# Altium project Powerboard V2 PCB Project.PrjPCB
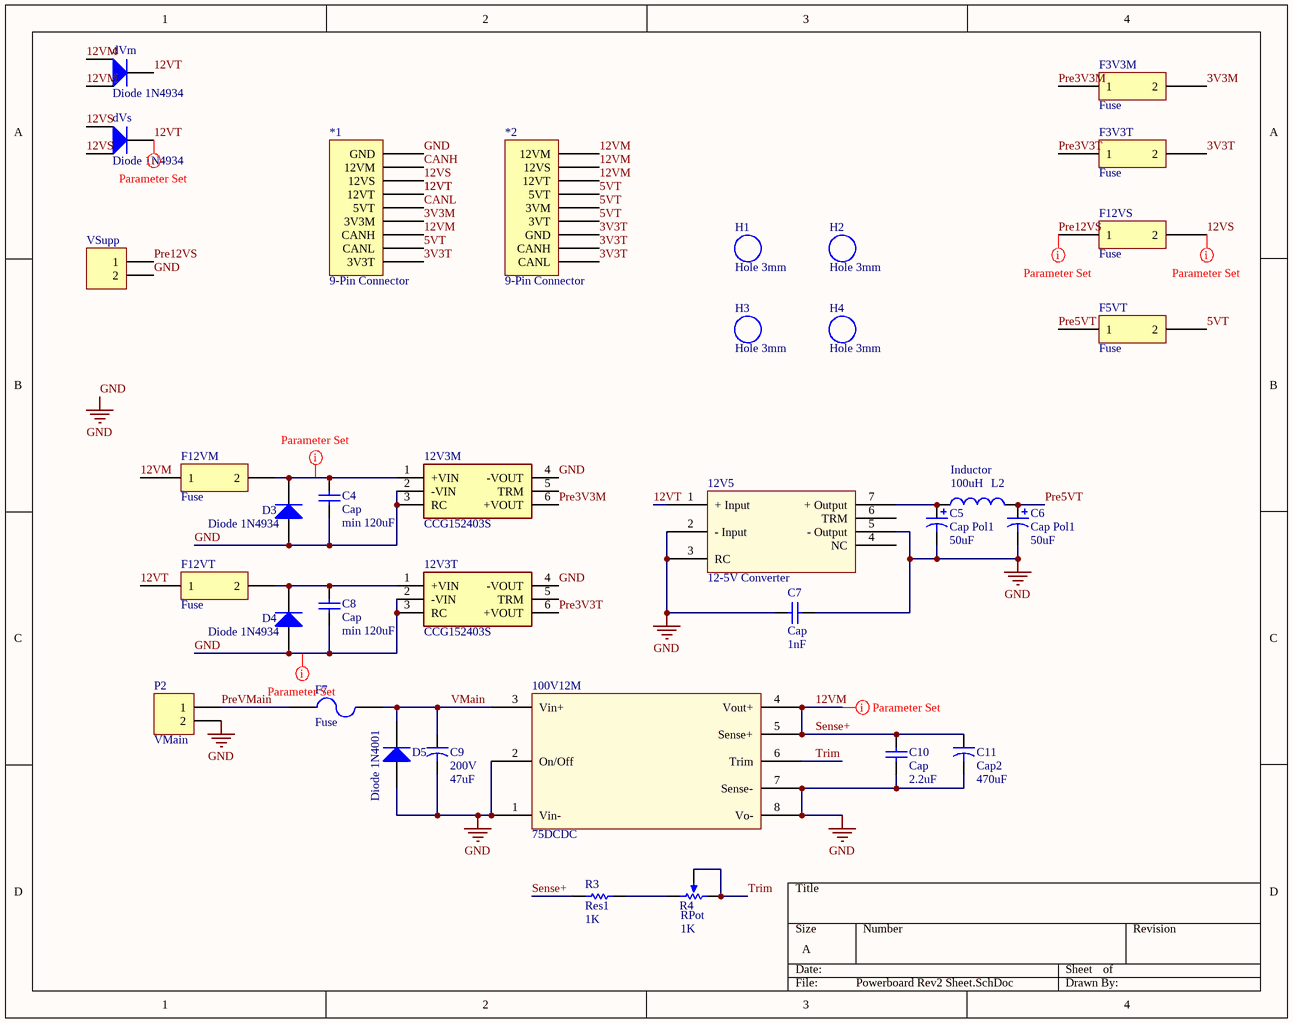
[diagram p0: Powerboard Rev2 Sheet.SchDoc]
1 sheet, 35 parts. Net scope: global (net labels, ports and power ports of the same name join across sheets).
Board files: Powerboard V2 Logo Fixed.PcbDoc, Powerboard Rev 2.PcbDoc

## Sheet Powerboard Rev2 Sheet.SchDoc
size A

### Parts
12V3M  CCG152403S  [CCG152403S]
12V3T  CCG152403S  [CCG152403S]
12V5  12-5V Converter  [CC6-1205SF-E]
100V12M  75DCDC  [100DC12]
*1  9-Pin Connector  [9-Pin]
*2  9-Pin Connector  [9-Pin]
C4  Cap  value min 120uF  [200mm Cap]
C5  Cap Pol1  value 50uF  [200milCap]
C6  Cap Pol1  value 50uF  [200milCap]
C7  Cap  value 1nF  [100milCap]
C8  Cap  value min 120uF  [200mm Cap]
C9  200V  value 47uF  [200milCap]
C10  Cap  value 2.2uF  [100milCap]
C11  Cap2  value 470uF  [200milCap]
D3  Diode 1N4934  [2pinDiode]
D4  Diode 1N4934  [2pinDiode]
D5  Diode 1N4001  [2pinDiode]
dVm  Diode 1N4934  [3pindiode]
dVs  Diode 1N4934  [3pindiode]
F3V3M  Fuse  [Fuse Hilder]
F3V3T  Fuse  [Fuse Hilder]
F5VT  Fuse  [Fuse Hilder]
F7  Fuse  [Fuse Hilder]
F12VM  Fuse  [Fuse Hilder]
F12VS  Fuse  [Fuse Hilder]
F12VT  Fuse  [Fuse Hilder]
H1  Hole 3mm  [Hole 3mm]
H2  Hole 3mm  [Hole 3mm]
H3  Hole 3mm  [Hole 3mm]
H4  Hole 3mm  [Hole 3mm]
L2  Inductor  value 100uH  [Inductor]
P2  VMain  [HDR1X2]
R3  Res1  value 1K  [AXIAL-0.3]
R4  RPot  value 1K  [POT inline wide]
VSupp  (no value)  [HDR1X2]

### Nets
GND: 12V3M.2(-VIN) 12V3M.3(RC) 12V3M.4(-VOUT) 12V3T.2(-VIN) 12V3T.3(RC) 12V3T.4(-VOUT) 12V5.2(-_Input) 12V5.3(RC) 12V5.5(-_Output) 100V12M.1(Vin-) 100V12M.2(On/Off) 100V12M.7(Sense-) 100V12M.8(Vo-) *1.1(GND) C4.1 C5.2 C6.2 C7.1 C7.2 C8.1 C9.2 C10.1 C11.2 D3.1(A) D4.1(A) D5.1(A) P2.2 VSupp.2
3V3M: *1.6(3V3M) F3V3M.2
3V3T: *1.9(3V3T) *2.7(GND) *2.8(CANH) *2.9(CANL) F3V3T.2
5VT: *1.8(CANL) *2.4(5VT) *2.5(3VM) *2.6(3VT) F5VT.2
12VM: 100V12M.4(Vout+) 100V12M.5(Sense+) *1.7(CANH) *2.1(12VM) *2.2(12VS) *2.3(12VT) C10.2 C11.1 dVm.1(A) dVm.3(A) F12VM.1 R3.1  [also labelled Sense+]
12VS: *1.3(12VS) dVs.1(A) dVs.3(A) F12VS.2
12VT: 12V5.1(+_Input) *1.4(12VT) dVm.2(K) dVs.2(K) F12VT.1
CANH: *1.2(12VM)
CANL: *1.5(5VT)
Pre3V3M: 12V3M.6(+VOUT) F3V3M.1
Pre3V3T: 12V3T.6(+VOUT) F3V3T.1
Pre5VT: C6.1 F5VT.1 L2.2
Pre12VS: F12VS.1 VSupp.1
PreVMain: F7.1 P2.1
Trim: 100V12M.6(Trim) R4.1(TOP) R4.2(TAP)
VMain: 100V12M.3(Vin+) C9.1 D5.2(K) F7.2
Net12V3M_1: 12V3M.1(+VIN) C4.2 D3.2(K) F12VM.2
Net12V3T_1: 12V3T.1(+VIN) C8.2 D4.2(K) F12VT.2
Net12V5_7: 12V5.7(+_Output) C5.1 L2.1
NetR3_2: R3.2 R4.3(BOT)

Not connected (* = marked no-connect by the designer): 12V3M 5(TRM); 12V3T 5(TRM); 12V5 4(NC) 6(TRM)

### Layout directives
rule Width Constraint [Pref Width = 50mil    Min Width = 50mil    Max Width = 50mil]: 12VM, Net12V3M_1
rule Width Constraint [Pref Width = 30mil    Min Width = 30mil    Max Width = 30mil]: 12VS, 12VT, GND, Pre12VS

### Library data of the parts
12V3M 12V3T = CCG152403S: Power Supply; Manufacturer_Name: TDK LAMBDA; Datasheet Link: https://componentsearchengine.com/Datasheets/2/CCG152403S.pdf; Height: 9.9mm; Manufacturer_Part_Number: CCG152403S
C4 C7 C8 C10 = Cap: Capacitor; Published: 8-Jun-2000; LatestRevisionDate: 17-Jul-2002; LatestRevisionNote: Re-released for DXP Platform.; PackageReference: RAD-0.3; Publisher: Altium Limited; PackageDescription: Radial Cap, Thru-Hole; 2 Leads; 0.3 in Pin Spacing
C5 C6 = Cap Pol1: Polarized Capacitor (Radial); Published: 8-Jun-2000; LatestRevisionDate: 17-Jul-2002; LatestRevisionNote: Re-released for DXP Platform.; PackageReference: RB7.6-15; Publisher: Altium Limited; PackageDescription: Polarized Capacitor (Radial); 2 Leads
C9 C11 = Cap2: Capacitor; Published: 23-Sep-2002; PackageReference: CAPR5-4X5; Publisher: Altium Limited; PackageDescription: Capacitor; 2 Leads
D3 D4 = Diode 1N4934: 1 Amp Fast Recovery Rectifier; pin to pad: 2>3; Published: 8-Jun-2000; LatestRevisionDate: 17-Jul-2002; LatestRevisionNote: Re-released for DXP Platform.; DatasheetVersion: 1999; PackageVersion: Aug-1999; PackageReference: DO-41; Publisher: Altium Limited; PackageDescription: Diode, Axial; Body 5.2 x 2.7 mm (LxDia. max), Lead Dia. 0.86 mm (max); Code_JEDEC: DO-204-AL; ComponentLink1Description: Manufacturer Link; ComponentLink1URL: http://www.fairchildsemi.com/; ComponentLink2Description: Datasheet; ComponentLink2URL: http://www.fairchildsemi.com/ds/1N%2F1N4934.pdf
D5 = Diode 1N4001: 1 Amp General Purpose Rectifier; pin to pad: 2>3; Published: 8-Jun-2000; LatestRevisionDate: 17-Jul-2002; LatestRevisionNote: Re-released for DXP Platform.; DatasheetVersion: 1998; PackageVersion: Aug-1999; PackageReference: DO-41; Publisher: Altium Limited; PackageDescription: Diode, Axial; Body 5.2 x 2.7 mm (LxDia. max), Lead Dia. 0.86 mm (max); Code_JEDEC: DO-204-AL; ComponentLink1Description: Manufacturer Link; ComponentLink1URL: http://www.fairchildsemi.com/; ComponentLink2Description: Datasheet; ComponentLink2URL: http://www.fairchildsemi.com/ds/1N%2F1N4001.pdf
dVm dVs = Diode 1N4934: 1 Amp Fast Recovery Rectifier; Published: 8-Jun-2000; LatestRevisionDate: 17-Jul-2002; LatestRevisionNote: Re-released for DXP Platform.; DatasheetVersion: 1999; PackageVersion: Aug-1999; PackageReference: DO-41; Publisher: Altium Limited; PackageDescription: Diode, Axial; Body 5.2 x 2.7 mm (LxDia. max), Lead Dia. 0.86 mm (max); Code_JEDEC: DO-204-AL; ComponentLink1Description: Manufacturer Link; ComponentLink1URL: http://www.fairchildsemi.com/; ComponentLink2Description: Datasheet; ComponentLink2URL: http://www.fairchildsemi.com/ds/1N%2F1N4934.pdf
F7 = Fuse 2: Published: 8-Jun-2000; LatestRevisionDate: 17-Jul-2002; LatestRevisionNote: Re-released for DXP Platform.; PackageReference: PIN-W2/E2.8; Publisher: Altium Limited; PackageDescription: Thru-Hole; 2 Leads
L2 = Inductor: Code_IEC: 1005; Published: 8-Jun-2000; LatestRevisionDate: 29-May-2009; LatestRevisionNote: IPC-7351 Footprint Added.; PackageReference: 0402-A; Publisher: Altium Limited; PackageDescription: Chip Inductor; Code_JEITA: 0402
P2 VSupp = Header 2: Header, 2-Pin; LatestRevisionDate: 17-Jul-2002; LatestRevisionNote: Re-released for DXP Platform.; Publisher: Altium Limited
R3 = Res1: Resistor; Published: 8-Jun-2000; LatestRevisionDate: 17-Jul-2002; LatestRevisionNote: Re-released for DXP Platform.; PackageReference: AXIAL-0.3; Publisher: Altium Limited; PackageDescription: Axial Device, Thru-Hole; 2 Leads; 0.3 in Pin Spacing
R4 = RPot_3: Potentiometer; Sim Note: Enter the Resistance value and the set point into parameter fields.; Set Position: 0.5; Published: 8-Jun-2000; LatestRevisionDate: 17-Jul-2002; LatestRevisionNote: Re-released for DXP Platform.; PackageReference: VR5; Publisher: Altium Limited; PackageDescription: Variable Resistor, Thru-Hole; 3 Leads